# EAGLE design BatteryCharging (EAGLE 9.4.2)
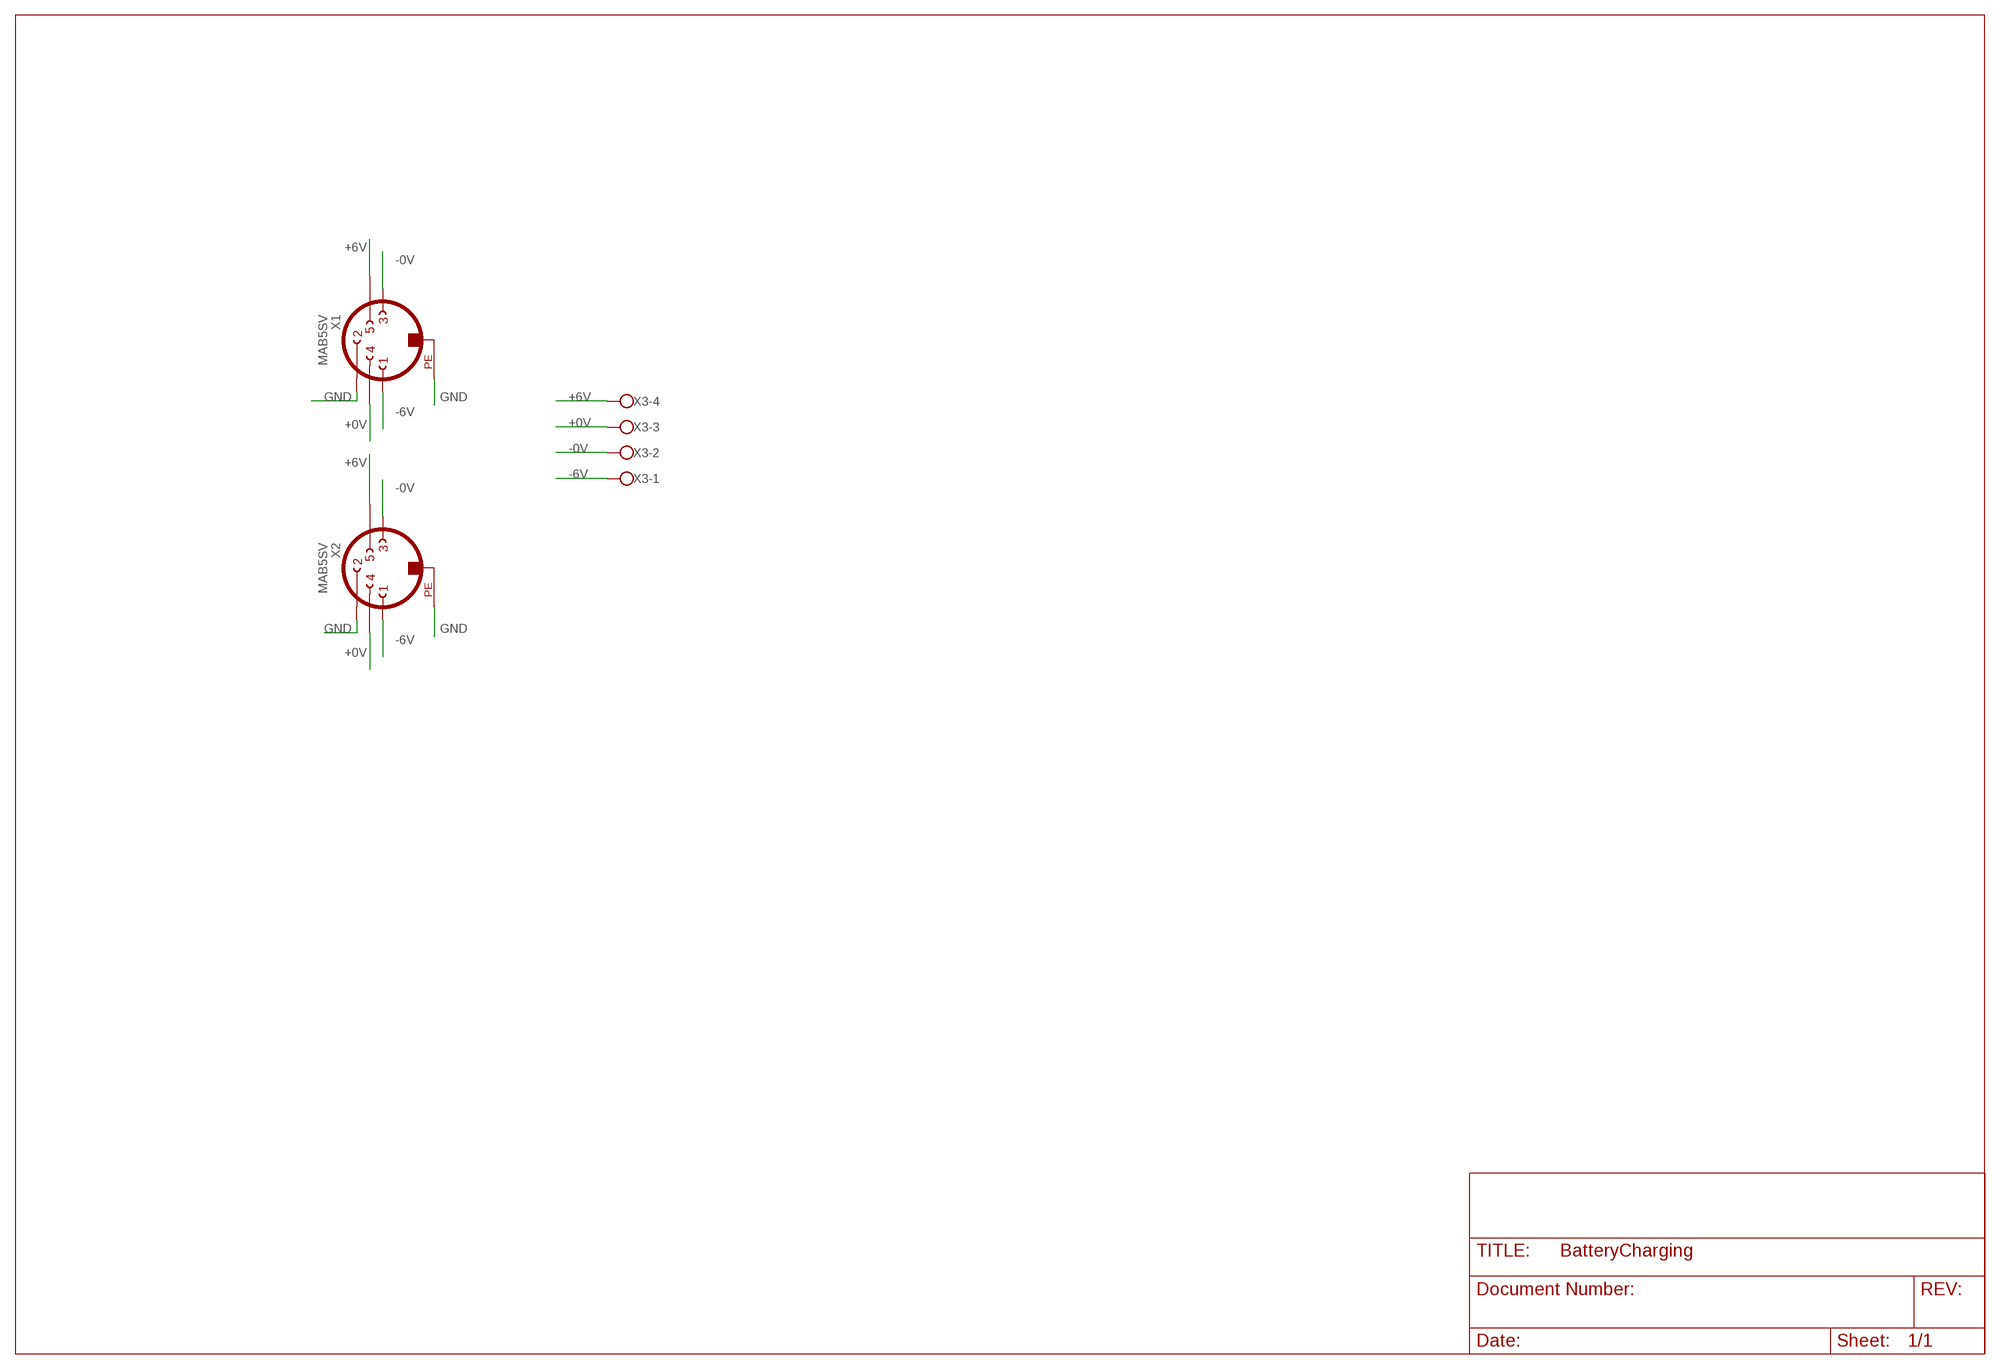
[diagram p0: schematic, sheet 1]

## Parts
X1  MAB5SV  [MAB5SV]
X2  MAB5SV  [MAB5SV]
X3  W237-4  [W237-4]

## Nets
+0V: X1.4 X2.4 X3.3
+6V: X1.5 X2.5 X3.4
-0V: X1.3 X2.3 X3.2
-6V: X1.1 X2.1 X3.1
GND: X1.2 X1.PE X2.2 X2.PE

## Library data of the parts
X1 X2 = con-hirschmann:MAB5SV: Female CONNECTOR 5 pins 90 deg. with shield, vertical (DIN41524); OC_FARNELL: unknown; OC_NEWARK: unknown
X3 = con-wago-500:W237-4: WAGO SCREW CLAMP; OC_FARNELL: unknown; OC_NEWARK: unknown

## Board
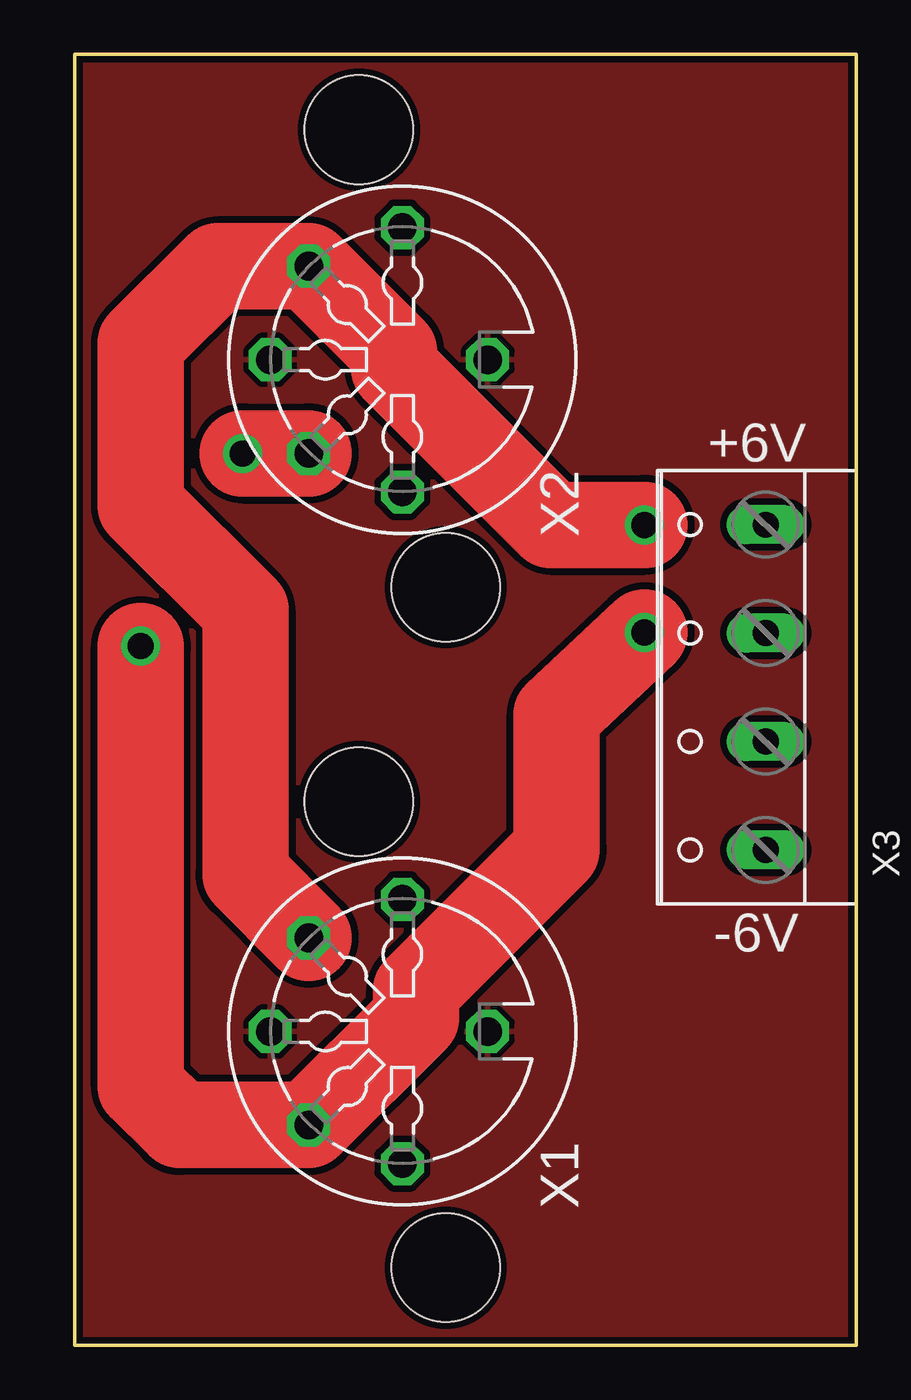
[diagram p1: board, top side]
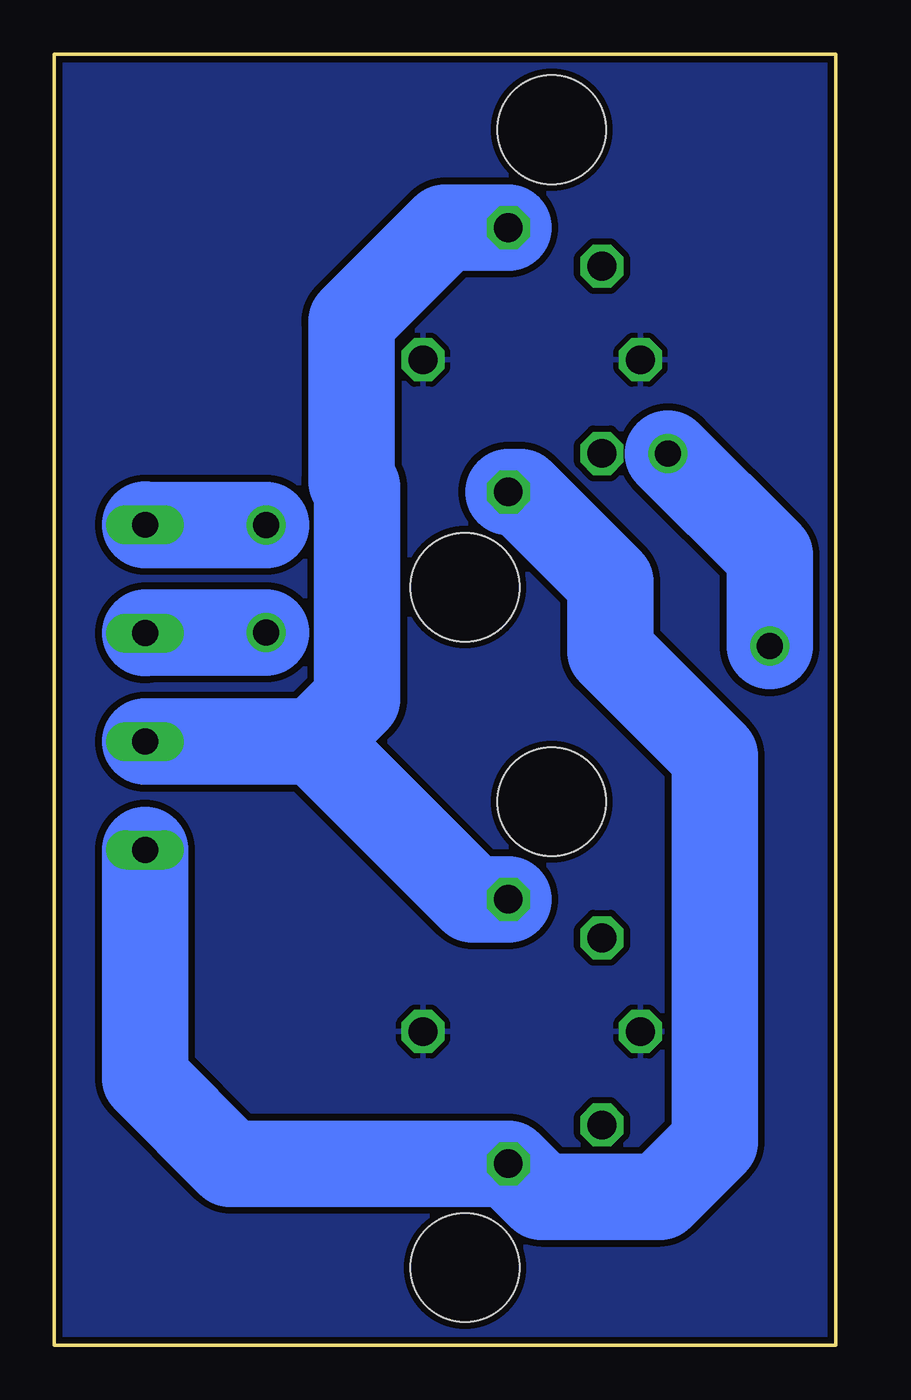
[diagram p2: board, bottom side, seen from below]

Size 36.07 x 59.56 mm. Coordinates in mm from the lower left corner, seen from the top.
Outline: 0,0 0,59.56 36.07,59.56 36.07,0 0,0
Copper layers (1*16): Top 0.035mm / dielectric 1.5mm / Bottom 0.035mm
Design rules "SparkFun": minimum track width 8mil, minimum drill 20mil, track to track 8mil, track to pad 8mil, pad to pad 8mil, via to via 8mil, smd to smd 8mil, copper to edge 8mil, drill to drill 8mil, minimum pad ring 12mil, minimum via ring 10mil, stop-mask expansion 4mil, vias tented up to drill 20mil, thermal gap 10mil
Holes 5 mm at 17.11,3.58 13.11,25.08 17.11,34.98 13.11,56.08

### Footprints (pad centres in the part's own frame; a part is rotated, then mirrored left to right if it is on the bottom)
MAB5SV = drill 1.321 octagon: 1 6.096,0; 2 0,-6.096; 3 -6.096,0; 4 4.318,-4.318; 5 -4.318,-4.318; PE 0,3.937
W237-4 = drill 1.194 long: 1 -7.5,-1.27; 2 -2.5,-1.27; 3 2.5,-1.27; 4 7.5,-1.27

### Placement (x,y rotation side)
X1  15.11,14.48 270 top
X2  15.11,45.47 270 top
X3  30.61,30.35 90 top

### Tracks (layer width: path | path; a pad name or v marks a point on that pad's centre or on a via)
+0V  (via drill 1.2)
  Top 4: v3.05,32.26 3.05,11.94 4.83,10.16 X1.4 15.75,15.11 15.75,16.38 22.23,22.86 22.23,29.08 v26.29,32.89 | v7.75,41.15 X2.4
  Bottom 4: v3.05,32.26 3.05,36.45 v7.75,41.15 | v26.29,32.89 31.84,32.89 X3.3
+6V  (via drill 1.2)
  Top 4: X1.5 7.87,21.72 7.87,33.91 3.05,38.73 3.05,46.23 6.6,49.78 X2.5 14.73,45.85 14.73,45.08 21.97,37.85 v26.29,37.85
  Bottom 4: v26.29,37.85 X3.4
-0V
  Bottom 4: X1.3 16.76,20.57 24.04,27.85 | X3.2 24.04,27.85 | X2.3 18.03,51.56 22.35,47.24 22.35,39.85 22.09,39.59 22.09,29.81 24.04,27.85
-6V
  Bottom 4: X2.1 14.56,39.37 10.41,35.22 10.41,32 5.59,27.18 5.59,9.4 8.13,6.86 13.59,6.86 X1.1 27.94,8.38 31.88,12.32 X3.1
GND
  pour Top (isolate 0.305): 0,59.56 36.07,59.56 36.07,0 0,0
  pour Bottom (isolate 0.305): 0,59.56 36.07,59.56 36.07,0 0,0

### Text on the board
tPlace: +6V | -6V